# Altium schematic sheet MCU_GUI.SchDoc
size A1; SheetNumber: 6; SheetTotal: 13
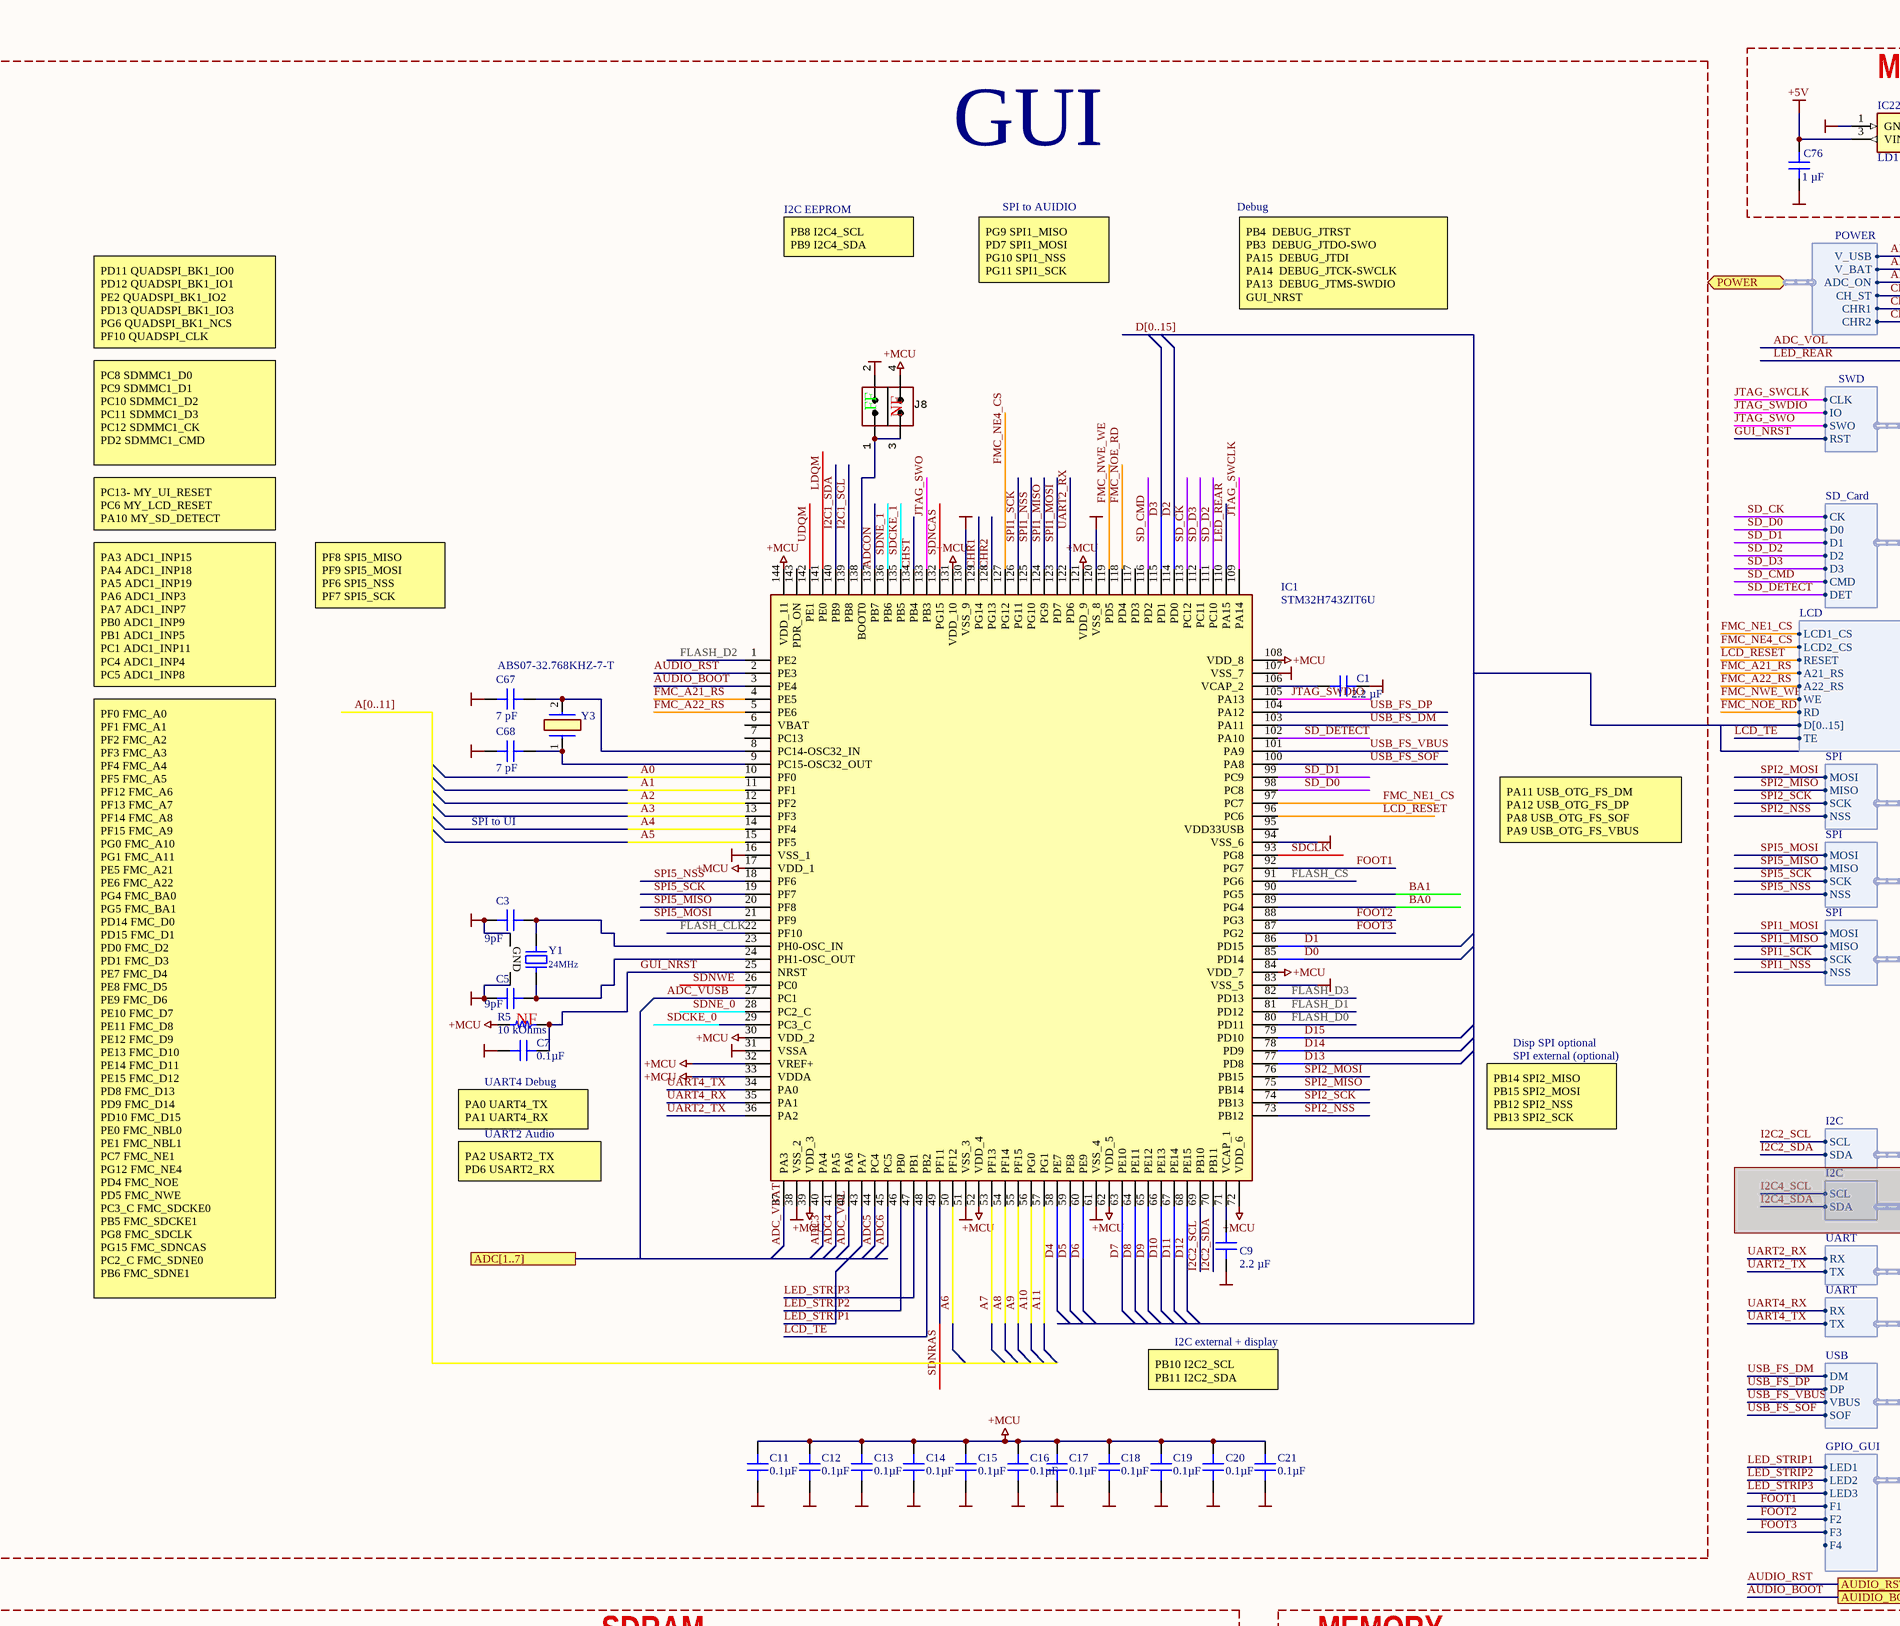
[diagram p0: MCU_GUI.SchDoc, top left]
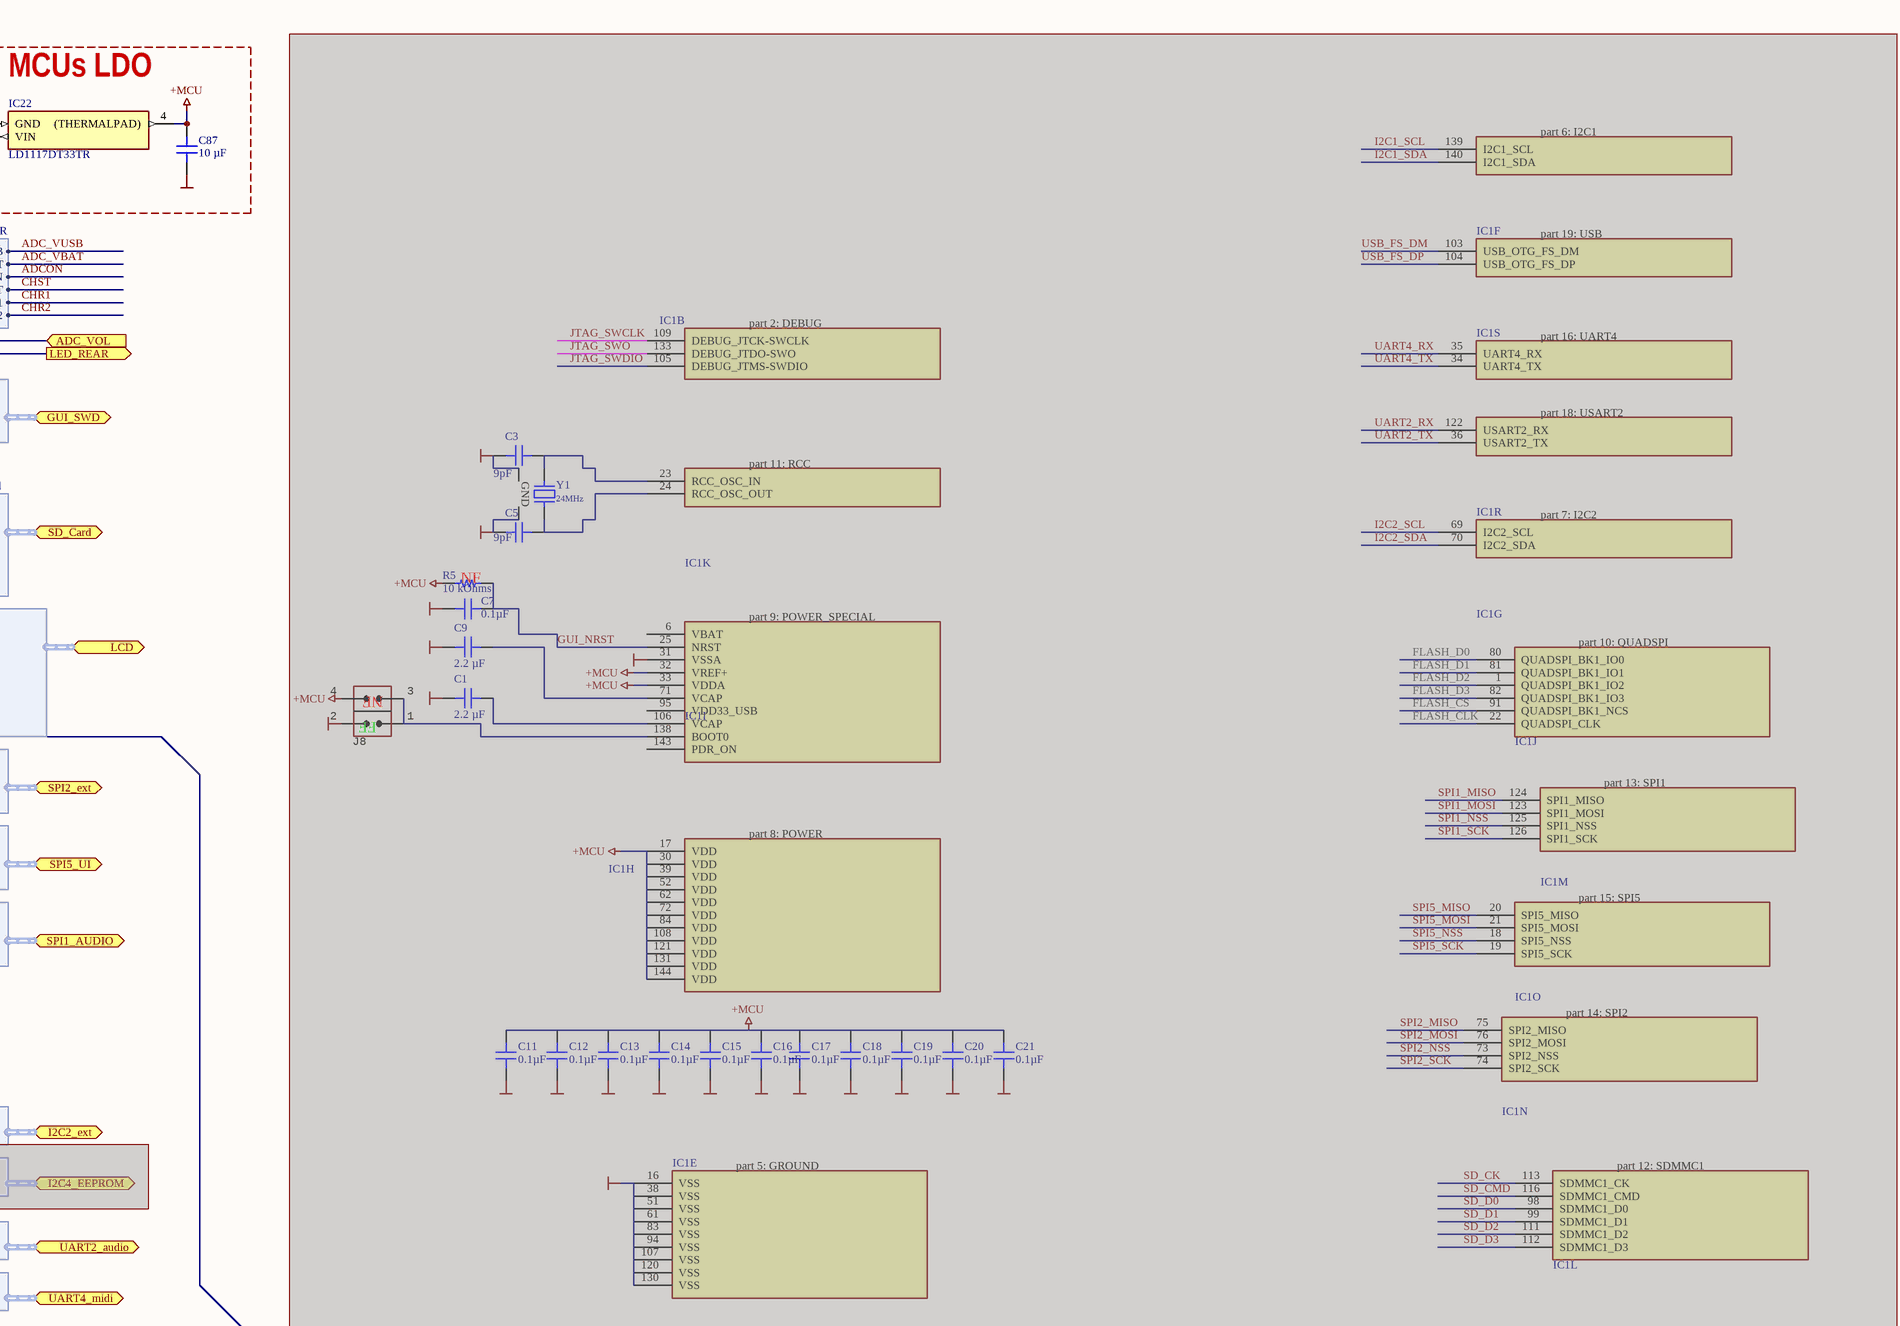
[diagram p1: MCU_GUI.SchDoc, top right]
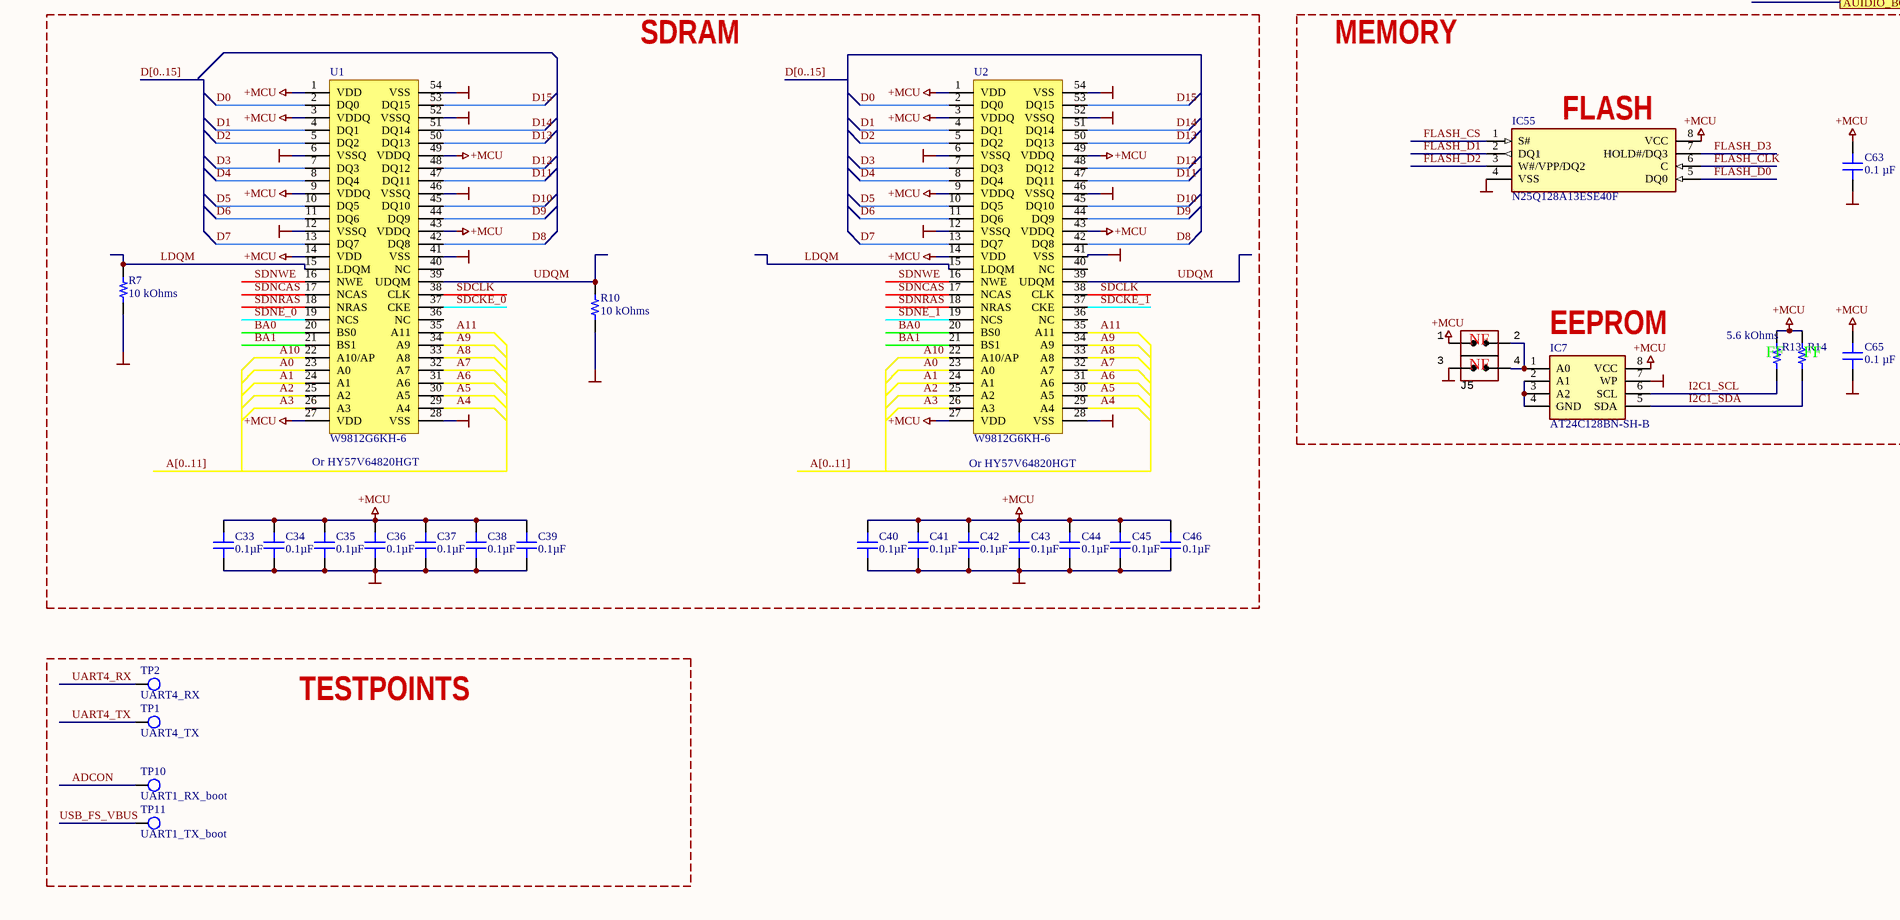
[diagram p2: MCU_GUI.SchDoc, bottom left]
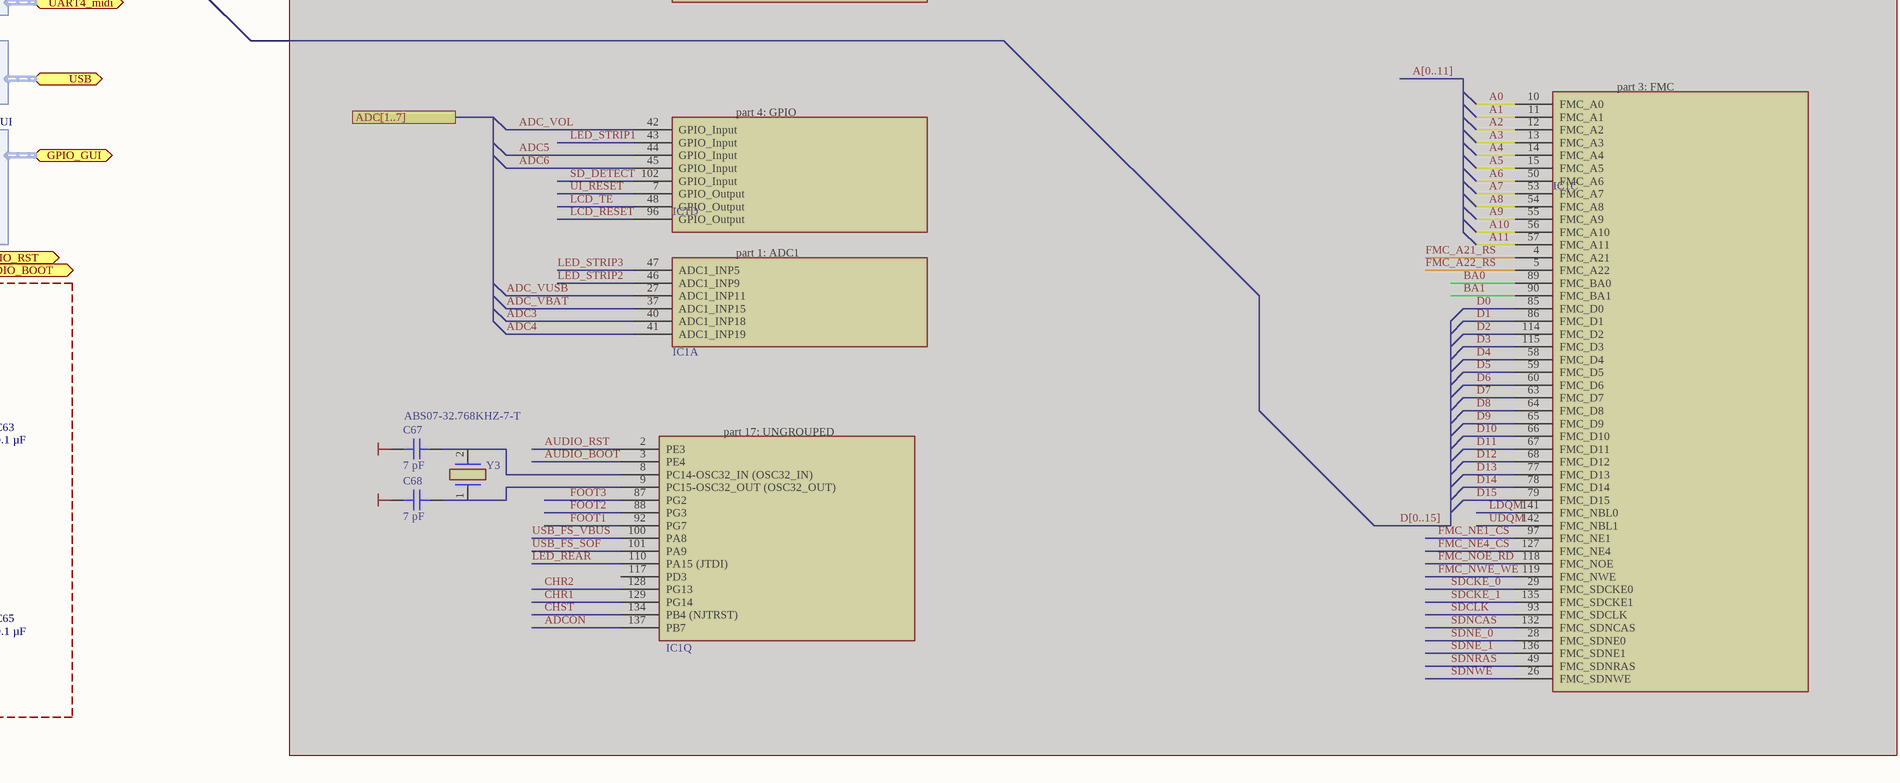
[diagram p3: MCU_GUI.SchDoc, bottom right]

## Parts
(Parts that share a designator on the sheet are numbered #1, #2 ... from top to bottom, then left to right.)
C1#1  2.2 µF  [CAP 0805_2012]
C1#2  2.2 µF  [CAP 0805_2012]  (masked out: inside a compile mask, not in the netlist)
C3#1  9pF  [CAP 0805_2012]  (masked out: inside a compile mask, not in the netlist)
C3#2  9pF  [CAP 0805_2012]
C5#1  9pF  [CAP 0805_2012]  (masked out: inside a compile mask, not in the netlist)
C5#2  9pF  [CAP 0805_2012]
C7#1  0.1µF  [CAP 0402_1005]  (masked out: inside a compile mask, not in the netlist)
C7#2  0.1µF  [CAP 0402_1005]
C9#1  2.2 µF  [CAP 0805_2012]  (masked out: inside a compile mask, not in the netlist)
C9#2  2.2 µF  [CAP 0805_2012]
C11#1  0.1µF  [CAP 0402_1005]  (masked out: inside a compile mask, not in the netlist)
C11#2  0.1µF  [CAP 0402_1005]
C12#1  0.1µF  [CAP 0402_1005]  (masked out: inside a compile mask, not in the netlist)
C12#2  0.1µF  [CAP 0402_1005]
C13#1  0.1µF  [CAP 0402_1005]  (masked out: inside a compile mask, not in the netlist)
C13#2  0.1µF  [CAP 0402_1005]
C14#1  0.1µF  [CAP 0402_1005]  (masked out: inside a compile mask, not in the netlist)
C14#2  0.1µF  [CAP 0402_1005]
C15#1  0.1µF  [CAP 0402_1005]  (masked out: inside a compile mask, not in the netlist)
C15#2  0.1µF  [CAP 0402_1005]
C16#1  0.1µF  [CAP 0402_1005]  (masked out: inside a compile mask, not in the netlist)
C16#2  0.1µF  [CAP 0402_1005]
C17#1  0.1µF  [CAP 0402_1005]  (masked out: inside a compile mask, not in the netlist)
C17#2  0.1µF  [CAP 0402_1005]
C18#1  0.1µF  [CAP 0402_1005]  (masked out: inside a compile mask, not in the netlist)
C18#2  0.1µF  [CAP 0402_1005]
C19#1  0.1µF  [CAP 0402_1005]  (masked out: inside a compile mask, not in the netlist)
C19#2  0.1µF  [CAP 0402_1005]
C20#1  0.1µF  [CAP 0402_1005]  (masked out: inside a compile mask, not in the netlist)
C20#2  0.1µF  [CAP 0402_1005]
C21#1  0.1µF  [CAP 0402_1005]  (masked out: inside a compile mask, not in the netlist)
C21#2  0.1µF  [CAP 0402_1005]
C33  0.1µF  [CAP 0402_1005]
C34  0.1µF  [CAP 0402_1005]
C35  0.1µF  [CAP 0402_1005]
C36  0.1µF  [CAP 0402_1005]
C37  0.1µF  [CAP 0402_1005]
C38  0.1µF  [CAP 0402_1005]
C39  0.1µF  [CAP 0402_1005]
C40  0.1µF  [CAP 0402_1005]
C41  0.1µF  [CAP 0402_1005]
C42  0.1µF  [CAP 0402_1005]
C43  0.1µF  [CAP 0402_1005]
C44  0.1µF  [CAP 0402_1005]
C45  0.1µF  [CAP 0402_1005]
C46  0.1µF  [CAP 0402_1005]
C63  0.1 µF  [CAP 0603_1608]
C65  0.1 µF  [CAP 0603_1608]
C67#1  7 pF  [CAP 0805_2012]
C67#2  7 pF  [CAP 0805_2012]  (masked out: inside a compile mask, not in the netlist)
C68#1  7 pF  [CAP 0805_2012]
C68#2  7 pF  [CAP 0805_2012]  (masked out: inside a compile mask, not in the netlist)
C76  1 µF  [CAP 0805_2012]
C87  10 µF  [CAP 0805_2012]
IC1#1  STM32H743ZIT6U  [QFP50P2200X2200X160-144N]
IC1#2  MCU_pinout_gui  [QFP50P2200X2200X160-144N]  (value not drawn)  (parts A,B,C,D,E,F,G,H,I,J,K,L,M,N,O,P,Q,R,S of 19)  (masked out: inside a compile mask, not in the netlist)
IC7  AT24C128BN-SH-B  [SOIC127P600X175-8N]
IC22  LD1117DT33TR  [TO228P972X240-3N]
IC55  N25Q128A13ESE40F  [SOIC127P790X216-8N]
J5  (no value)  [CON: JUMPER x2]
J8#1  (no value)  [CON: JUMPER x2]
J8#2  (no value)  [CON: JUMPER x2]  (masked out: inside a compile mask, not in the netlist)
R5#1  10 kOhms  [RES 0603_1608]  (masked out: inside a compile mask, not in the netlist)
R5#2  10 kOhms  [RES 0603_1608]
R7  10 kOhms  [RES 0603_1608]
R10  10 kOhms  [RES 0603_1608]
R13  5.6 kOhms  [RES 0603_1608]
R14  5.6 kOhms  [RES 0603_1608]  (value not drawn)
TP1  UART4_TX  [TESTPOINT_VIA]
TP2  UART4_RX  [TESTPOINT_VIA]
TP10  UART1_RX_boot  [TESTPOINT_VIA]
TP11  UART1_TX_boot  [TESTPOINT_VIA]
U1  W9812G6KH-6  [TSOP-54]
U2  W9812G6KH-6  [TSOP-54]
Y1#1  24MHz  [NDK NX3225SA]  (masked out: inside a compile mask, not in the netlist)
Y1#2  24MHz  [NDK NX3225SA]
Y3#1  ABS07-32.768KHZ-7-T  [ABS07]
Y3#2  ABS07-32.768KHZ-7-T  [ABS07]  (masked out: inside a compile mask, not in the netlist)

## Blocks framed on the sheet
MCUs LDO: C76 C87 IC22
GUI: C1#1 C3#2 C5#2 C7#2 C9#2 C11#2 C12#2 C13#2 C14#2 C15#2 C16#2 C17#2 C18#2 C19#2 C20#2 C21#2 C67#1 C68#1 IC1#1 J8#1 R5#2 Y1#2 Y3#1
SDRAM: C33-C46 R7 R10 U1 U2
TESTPOINTS: TP1 TP2 TP10 TP11

## Ports
ADC[1..7], ADC_VOL (in), AUDIO_RST (out), AUIDIO_BOOT (out), GPIO_GUI (bidir, harness GPIO_GUI), GUI_SWD (bidir, harness SWD), I2C2_ext (bidir, harness I2C), I2C4_EEPROM (bidir, harness I2C), LCD (bidir, harness LCD), LED_REAR (out), POWER (bidir, harness POWER), SD_Card (bidir, harness SD_Card), SPI1_AUDIO (bidir, harness SPI), SPI2_ext (bidir, harness SPI), SPI5_UI (bidir, harness SPI), UART2_audio (bidir, harness UART), UART4_midi (bidir, harness UART), USB (bidir, harness USB)

## Harnesses
SD_Card: CK, D0, D1, D2, D3, CMD, DET
SPI: MOSI, MISO, SCK, NSS
I2C: SCL, SDA
USB: DM, DP, VBUS, SOF
UART: RX, TX
SWD: CLK, IO, SWO, RST
POWER: V_USB, V_BAT, ADC_ON, CH_ST, CHR1, CHR2
GPIO_GUI: LED1, LED2, F1, F2, F3, F4, LED3
LCD: LCD1_CS, LCD2_CS, RESET, A21_RS, A22_RS, WE, RD, D[0..15], TE

## Nets
+5V: C76.2 IC22.3(VIN)
+MCU: C11#2.1 C12#2.1 C13#2.1 C14#2.1 C15#2.1 C16#2.1 C17#2.1 C18#2.1 C19#2.1 C20#2.1 C21#2.1 C33.1 C34.1 C35.1 C36.1 C37.1 C38.1 C39.1 C40.1 C41.1 C42.1 C43.1 C44.1 C45.1 C46.1 C63.2 C65.2 C87.2 IC1#1.17(VDD_1) IC1#1.30(VDD_2) IC1#1.32(VREF+) IC1#1.33(VDDA) IC1#1.39(VDD_3) IC1#1.52(VDD_4) IC1#1.62(VDD_5) IC1#1.72(VDD_6) IC1#1.84(VDD_7) IC1#1.108(VDD_8) IC1#1.121(VDD_9) IC1#1.131(VDD_10) IC1#1.144(VDD_11) IC7.8(VCC) IC22.4((THERMALPAD)) IC55.8(VCC) J5.1(IN) J8#1.4(IN) R5#2.1 R13.2 R14.2 U1.1(VDD) U1.3(VDDQ) U1.9(VDDQ) U1.14(VDD) U1.27(VDD) U1.43(VDDQ) U1.49(VDDQ) U2.1(VDD) U2.3(VDDQ) U2.9(VDDQ) U2.14(VDD) U2.27(VDD) U2.43(VDDQ) U2.49(VDDQ)
GND: C1#1.2 C3#2.1 C5#2.1 C7#2.1 C9#2.1 C11#2.2 C12#2.2 C13#2.2 C14#2.2 C15#2.2 C16#2.2 C17#2.2 C18#2.2 C19#2.2 C20#2.2 C21#2.2 C33.2 C34.2 C35.2 C36.2 C37.2 C38.2 C39.2 C40.2 C41.2 C42.2 C43.2 C44.2 C45.2 C46.2 C63.1 C65.1 C67#1.1 C68#1.1 C76.1 C87.1 IC1#1.16(VSS_1) IC1#1.31(VSSA) IC1#1.38(VSS_2) IC1#1.51(VSS_3) IC1#1.61(VSS_4) IC1#1.83(VSS_5) IC1#1.94(VSS_6) IC1#1.107(VSS_7) IC1#1.120(VSS_8) IC1#1.130(VSS_9) IC7.7(WP) IC22.1(GND) IC55.4(VSS) J5.3(IN) J8#1.2(IN) R7.1 R10.1 U1.6(VSSQ) U1.12(VSSQ) U1.28(VSS) U1.41(VSS) U1.46(VSSQ) U1.52(VSSQ) U1.54(VSS) U2.6(VSSQ) U2.12(VSSQ) U2.28(VSS) U2.41(VSS) U2.46(VSSQ) U2.52(VSSQ) U2.54(VSS) Y1#2.2(GND) Y1#2.4(GND)
A0: IC1#1.10(PF0) U1.23(A0) U2.23(A0)
A1: IC1#1.11(PF1) U1.24(A1) U2.24(A1)
A2: IC1#1.12(PF2) U1.25(A2) U2.25(A2)
A3: IC1#1.13(PF3) U1.26(A3) U2.26(A3)
A4: IC1#1.14(PF4) U1.29(A4) U2.29(A4)
A5: IC1#1.15(PF5) U1.30(A5) U2.30(A5)
A6: IC1#1.50(PF12) U1.31(A6) U2.31(A6)
A7: IC1#1.53(PF13) U1.32(A7) U2.32(A7)
A8: IC1#1.54(PF14) U1.33(A8) U2.33(A8)
A9: IC1#1.55(PF15) U1.34(A9) U2.34(A9)
A10: IC1#1.56(PG0) U1.22(A10/AP) U2.22(A10/AP)
A11: IC1#1.57(PG1) U1.35(A11) U2.35(A11)
ADC3: IC1#1.40(PA4)
ADC4: IC1#1.41(PA5)
ADC5: IC1#1.44(PC4)
ADC6: IC1#1.45(PC5)
ADC_VBAT: IC1#1.37(PA3) ; port POWER.V_BAT
ADC_VOL: IC1#1.42(PA6) ; port ADC_VOL
ADC_VUSB: IC1#1.27(PC1) ; port POWER.V_USB
ADCON: IC1#1.137(PB7) TP10.1 ; port POWER.ADC_ON
AUDIO_BOOT: IC1#1.3(PE4) ; port AUIDIO_BOOT
AUDIO_RST: IC1#1.2(PE3) ; port AUDIO_RST
BA0: IC1#1.89(PG4) U1.20(BS0) U2.20(BS0)
BA1: IC1#1.90(PG5) U1.21(BS1) U2.21(BS1)
CHR1: IC1#1.129(PG14) ; port POWER.CHR1
CHR2: IC1#1.128(PG13) ; port POWER.CHR2
CHST: IC1#1.134(PB4) ; port POWER.CH_ST
D0: IC1#1.85(PD14) U1.2(DQ0) U2.2(DQ0)
D1: IC1#1.86(PD15) U1.4(DQ1) U2.4(DQ1)
D2: IC1#1.114(PD0) U1.5(DQ2) U2.5(DQ2)
D3: IC1#1.115(PD1) U1.7(DQ3) U2.7(DQ3)
D4: IC1#1.58(PE7) U1.8(DQ4) U2.8(DQ4)
D5: IC1#1.59(PE8) U1.10(DQ5) U2.10(DQ5)
D6: IC1#1.60(PE9) U1.11(DQ6) U2.11(DQ6)
D7: IC1#1.63(PE10) U1.13(DQ7) U2.13(DQ7)
D8: IC1#1.64(PE11) U1.42(DQ8) U2.42(DQ8)
D9: IC1#1.65(PE12) U1.44(DQ9) U2.44(DQ9)
D10: IC1#1.66(PE13) U1.45(DQ10) U2.45(DQ10)
D11: IC1#1.67(PE14) U1.47(DQ11) U2.47(DQ11)
D12: IC1#1.68(PE15) U1.48(DQ12) U2.48(DQ12)
D13: IC1#1.77(PD8) U1.50(DQ13) U2.50(DQ13)
D14: IC1#1.78(PD9) U1.51(DQ14) U2.51(DQ14)
D15: IC1#1.79(PD10) U1.53(DQ15) U2.53(DQ15)
FLASH_CLK: IC1#1.22(PF10) IC55.6(C)
FLASH_CS: IC1#1.91(PG6) IC55.1(S#)
FLASH_D0: IC1#1.80(PD11) IC55.5(DQ0)
FLASH_D1: IC1#1.81(PD12) IC55.2(DQ1)
FLASH_D2: IC1#1.1(PE2) IC55.3(W#/VPP/DQ2)
FLASH_D3: IC1#1.82(PD13) IC55.7(HOLD#/DQ3)
FMC_A21_RS: IC1#1.4(PE5) ; port LCD.A21_RS
FMC_A22_RS: IC1#1.5(PE6) ; port LCD.A22_RS
FMC_NE1_CS: IC1#1.97(PC7) ; port LCD.LCD1_CS
FMC_NE4_CS: IC1#1.127(PG12) ; port LCD.LCD2_CS
FMC_NOE_RD: IC1#1.118(PD4) ; port LCD.RD
FMC_NWE_WE: IC1#1.119(PD5) ; port LCD.WE
FOOT1: IC1#1.92(PG7) ; port GPIO_GUI.F1
FOOT2: IC1#1.88(PG3) ; port GPIO_GUI.F2
FOOT3: IC1#1.87(PG2) ; port GPIO_GUI.F3
GUI_NRST: C7#2.2 IC1#1.25(NRST) R5#2.2 ; port GUI_SWD.RST
I2C1_SCL: IC1#1.139(PB8) IC7.6(SCL) R13.1
I2C1_SDA: IC1#1.140(PB9) IC7.5(SDA) R14.1
I2C2_SCL: IC1#1.69(PB10) ; port I2C2_ext.SCL
I2C2_SDA: IC1#1.70(PB11) ; port I2C2_ext.SDA
JTAG_SWCLK: IC1#1.109(PA14) ; port GUI_SWD.CLK
JTAG_SWDIO: IC1#1.105(PA13) ; port GUI_SWD.IO
JTAG_SWO: IC1#1.133(PB3) ; port GUI_SWD.SWO
LCD_RESET: IC1#1.96(PC6) ; port LCD.RESET
LCD_TE: IC1#1.48(PB2) ; port LCD.TE
LDQM: IC1#1.141(PE0) R7.2 U1.15(LDQM) U2.15(LDQM)
LED_REAR: IC1#1.110(PA15) ; port LED_REAR
LED_STRIP1: IC1#1.43(PA7) ; port GPIO_GUI.LED1
LED_STRIP2: IC1#1.46(PB0) ; port GPIO_GUI.LED2
LED_STRIP3: IC1#1.47(PB1) ; port GPIO_GUI.LED3
SD_CK: IC1#1.113(PC12) ; port SD_Card.CK
SD_CMD: IC1#1.116(PD2) ; port SD_Card.CMD
SD_D0: IC1#1.98(PC8) ; port SD_Card.D0
SD_D1: IC1#1.99(PC9) ; port SD_Card.D1
SD_D2: IC1#1.111(PC10) ; port SD_Card.D2
SD_D3: IC1#1.112(PC11) ; port SD_Card.D3
SD_DETECT: IC1#1.102(PA10) ; port SD_Card.DET
SDCKE_0: IC1#1.29(PC3_C) U1.37(CKE)
SDCKE_1: IC1#1.135(PB5) U2.37(CKE)
SDCLK: IC1#1.93(PG8) U1.38(CLK) U2.38(CLK)
SDNCAS: IC1#1.132(PG15) U1.17(NCAS) U2.17(NCAS)
SDNE_0: IC1#1.28(PC2_C) U1.19(NCS)
SDNE_1: IC1#1.136(PB6) U2.19(NCS)
SDNRAS: IC1#1.49(PF11) U1.18(NRAS) U2.18(NRAS)
SDNWE: IC1#1.26(PC0) U1.16(NWE) U2.16(NWE)
SPI1_MISO: IC1#1.124(PG9) ; port SPI1_AUDIO.MISO
SPI1_MOSI: IC1#1.123(PD7) ; port SPI1_AUDIO.MOSI
SPI1_NSS: IC1#1.125(PG10) ; port SPI1_AUDIO.NSS
SPI1_SCK: IC1#1.126(PG11) ; port SPI1_AUDIO.SCK
SPI2_MISO: IC1#1.75(PB14) ; port SPI2_ext.MISO
SPI2_MOSI: IC1#1.76(PB15) ; port SPI2_ext.MOSI
SPI2_NSS: IC1#1.73(PB12) ; port SPI2_ext.NSS
SPI2_SCK: IC1#1.74(PB13) ; port SPI2_ext.SCK
SPI5_MISO: IC1#1.20(PF8) ; port SPI5_UI.MISO
SPI5_MOSI: IC1#1.21(PF9) ; port SPI5_UI.MOSI
SPI5_NSS: IC1#1.18(PF6) ; port SPI5_UI.NSS
SPI5_SCK: IC1#1.19(PF7) ; port SPI5_UI.SCK
UART2_RX: IC1#1.122(PD6) ; port UART2_audio.RX
UART2_TX: IC1#1.36(PA2) ; port UART2_audio.TX
UART4_RX: IC1#1.35(PA1) TP2.1 ; port UART4_midi.RX
UART4_TX: IC1#1.34(PA0) TP1.1 ; port UART4_midi.TX
UDQM: IC1#1.142(PE1) R10.2 U1.39(UDQM) U2.39(UDQM)
USB_FS_DM: IC1#1.103(PA11) ; port USB.DM
USB_FS_DP: IC1#1.104(PA12) ; port USB.DP
USB_FS_SOF: IC1#1.100(PA8) ; port USB.SOF
USB_FS_VBUS: IC1#1.101(PA9) TP11.1 ; port USB.VBUS
NetC1#1_1: C1#1.1 IC1#1.106(VCAP_2)
NetC3#2_2: C3#2.2 IC1#1.23(PH0-OSC_IN) Y1#2.1
NetC5#2_2: C5#2.2 IC1#1.24(PH1-OSC_OUT) Y1#2.3
NetC9#2_2: C9#2.2 IC1#1.71(VCAP_1)
NetC67#1_2: C67#1.2 IC1#1.8(PC14-OSC32_IN) Y3#1.2
NetC68#1_2: C68#1.2 IC1#1.9(PC15-OSC32_OUT) Y3#1.1
NetIC1#1_138: IC1#1.138(BOOT0) J8#1.1(IN) J8#1.3(IN)
NetIC7_1: IC7.1(A0) J5.2(IN) J5.4(IN)
NetIC7_2: IC7.2(A1) IC7.3(A2) IC7.4(GND)

Not connected (* = marked no-connect by the designer): IC1#1 6(VBAT) 7(PC13) 95(VDD33USB) 117(PD3) 143(PDR_ON); U1 36(NC) 40(NC); U2 36(NC) 40(NC)

## Buses and harness runs
bus A[0..11]
bus D[0..15]

## Notes on the sheet
- I2C EEPROM
- SPI to AUIDIO
- Debug
- PB8	I2C4_SCL
  PB9	I2C4_SDA
- PG9	SPI1_MISO
  PD7	SPI1_MOSI
  PG10	SPI1_NSS
  PG11	SPI1_SCK
- PD11	QUADSPI_BK1_IO0
  PD12	QUADSPI_BK1_IO1
  PE2	QUADSPI_BK1_IO2
  PD13	QUADSPI_BK1_IO3
  PG6	QUADSPI_BK1_NCS
  PF10	QUADSPI_CLK
- PB4 	DEBUG_JTRST
  PB3 	DEBUG_JTDO-SWO
  PA15 	DEBUG_JTDI
  PA14 	DEBUG_JTCK-SWCLK
  PA13 	DEBUG_JTMS-SWDIO
  GUI_NRST
- (near J8#1) FF
- (near J8#1) NF
- PC8	SDMMC1_D0
  PC9	SDMMC1_D1
  PC10	SDMMC1_D2
  PC11	SDMMC1_D3
  PC12	SDMMC1_CK
  PD2	SDMMC1_CMD
- PC13-	MY_UI_RESET
  PC6	MY_LCD_RESET
  PA10	MY_SD_DETECT
- PF8	SPI5_MISO
  PF9	SPI5_MOSI
  PF6	SPI5_NSS
  PF7	SPI5_SCK
- (near R5#1) NF
- PA3	ADC1_INP15
  PA4	ADC1_INP18
  PA5	ADC1_INP19
  PA6	ADC1_INP3
  PA7	ADC1_INP7
  PB0	ADC1_INP9
  PB1	ADC1_INP5
  PC1	ADC1_INP11
  PC4	ADC1_INP4
  PC5	ADC1_INP8
- (near J8#2) FF
- (near J8#2) NF
- SPI to UI
- PA11	USB_OTG_FS_DM
  PA12	USB_OTG_FS_DP
  PA8	USB_OTG_FS_SOF
  PA9	USB_OTG_FS_VBUS
- (near R5#2) NF
- Disp SPI optional
- SPI external (optional)
- (near C7#2) PA0	UART4_TX
  PA1	UART4_RX
- (near C7#2) UART4 Debug
- PB14	SPI2_MISO
  PB15	SPI2_MOSI
  PB12	SPI2_NSS
  PB13	SPI2_SCK
- PA2	USART2_TX
  PD6	USART2_RX
- UART2 Audio
- PF0	FMC_A0
  PF1	FMC_A1
  PF2	FMC_A2
  PF3	FMC_A3
  PF4	FMC_A4
  PF5	FMC_A5
  PF12	FMC_A6
  PF13	FMC_A7
  PF14	FMC_A8
  PF15	FMC_A9
  PG0	FMC_A10
  PG1	FMC_A11
  PE5	FMC_A21
  PE6	FMC_A22
  PG4	FMC_BA0
  PG5	FMC_BA1
  PD14	FMC_D0
  PD15	FMC_D1
  PD0	FMC_D2
  PD1	FMC_D3
  PE7	FMC_D4
  PE8	FMC_D5
  PE9	FMC_D6
  PE10	FMC_D7
  PE11	FMC_D8
  PE12	FMC_D9
  PE13	FMC_D10
  PE14	FMC_D11
  PE15	FMC_D12
  PD8	FMC_D13
  PD9	FMC_D14
  PD10	FMC_D15
  PE0	FMC_NBL0
  PE1	FMC_NBL1
  PC7	FMC_NE1
  PG12	FMC_NE4
  PD4	FMC_NOE
  PD5	FMC_NWE
  PC3_C	FMC_SDCKE0
  PB5	FMC_SDCKE1
  PG8	FMC_SDCLK
  PG15	FMC_SDNCAS
  PC2_C	FMC_SDNE0
  PB6	FMC_SDNE1
- PB10	I2C2_SCL
  PB11	I2C2_SDA
- I2C external + display
- MEMORY
- (near IC55) FLASH
- (near J5) NF
- (near IC7) EEPROM
- (near R13) FF
- (near R14) FF
- (near U1) Or HY57V64820HGT
- (near U2) Or HY57V64820HGT
- (in symbol MCU_pinout_gui, part A) part 1: ADC1
- (in symbol MCU_pinout_gui, part B) part 2: DEBUG
- (in symbol MCU_pinout_gui, part C) part 3: FMC
- (in symbol MCU_pinout_gui, part D) part 4: GPIO
- (in symbol MCU_pinout_gui, part E) part 5: GROUND
- (in symbol MCU_pinout_gui, part F) part 6: I2C1
- (in symbol MCU_pinout_gui, part G) part 7: I2C2
- (in symbol MCU_pinout_gui, part H) part 8: POWER
- (in symbol MCU_pinout_gui, part I) part 9: POWER_SPECIAL
- (in symbol MCU_pinout_gui, part J) part 10: QUADSPI
- (in symbol MCU_pinout_gui, part K) part 11: RCC
- (in symbol MCU_pinout_gui, part L) part 12: SDMMC1
- (in symbol MCU_pinout_gui, part M) part 13: SPI1
- (in symbol MCU_pinout_gui, part N) part 14: SPI2
- (in symbol MCU_pinout_gui, part O) part 15: SPI5
- (in symbol MCU_pinout_gui, part P) part 16: UART4
- (in symbol MCU_pinout_gui, part Q) part 17: UNGROUPED
- (in symbol MCU_pinout_gui, part R) part 18: USART2
- (in symbol MCU_pinout_gui, part S) part 19: USB

## Library data of the parts
C1#1 C1#2 C9#1 C9#2 = C0805C225K8RAC7800: CAP CER 2.2UF 10V X7R 0805; manufacturer: KEMET; Tolerance: ±10%; Part Number: C0805C225K8RAC7800; Value: 2.2 µF; Applications: Bypass, Decoupling; Capacitance: 2.2 µF; componentlink1description: Datasheet; componentlink1url: https://api.kemet.com/component-edge/download/datasheet/C0805C225K8RACTU.pdf; componentlink2description: DigiKey Link; componentlink2url: https://www.digikey.com/en/products/detail/kemet/C0805C225K8RAC7800/789654; Device Package: 0805 (2012 Metric); lastupdated: 3/27/2023 7:09:32 PM; Lifecycle Status: Active; Minimum Order: 1; Mounting Type: Surface Mount, MLCC; Operating Temperature: -55°C ~ 125°C; Package / Case: 0805 (2012 Metric); packaging: TapeAndReel; partid: 32363; Part Status: Active; price: 0.03; series: SMD Comm X7R; Size / Dimension: 0.079" L x 0.049" W (2.00mm x 1.25mm); Supplier 1: DigiKey; Supplier Part Number 1: 399-C0805C225K8RAC7800CT-ND; Temperature Coefficient: X7R; Thickness (Max): 0.055" (1.40mm); Voltage - Rated: 10V
C3#1 C3#2 C5#1 C5#2 = CBR08C909CAGAC: CAP CER 9PF 250V C0G/NP0 0805; Manufacturer: KEMET; Temperature Coefficient: C0G, NP0; Tolerance: ±0.25pF; Part Number: CBR08C909CAGAC; Value: 9pF; Applications: RF, Microwave, High Frequency; Capacitance: 9pF; ComponentLink1Description: Datasheet; ComponentLink1URL: https://api.kemet.com/component-edge/download/datasheet/CBR08C909CAGAC.pdf; ComponentLink2Description: DigiKey Link; ComponentLink2URL: http://digikey.com/product-detail/en/kemet/CBR08C909CAGAC/399-8711-1-ND/3480335; Device Package: 0805 (2012 Metric); Features: High Q, Low Loss, Ultra Low ESR; LastUpdated: 9/2/2020 1:04:31 AM; Lifecycle Status: Active; Minimum Order: 1; Mounting Type: Surface Mount, MLCC; Operating Temperature: -55°C ~ 125°C; Package / Case: 0805 (2012 Metric); Packaging: TapeAndReel; PartId: 8592; Part Status: Active; Price: 0.28; Series: CBR-SMD RF C0G; Size / Dimension: 0.079" L x 0.049" W (2.00mm x 1.25mm); Supplier 1: DigiKey; Supplier Part Number 1: 399-8711-1-ND; Thickness (Max): 0.035" (0.88mm); Voltage - Rated: 250V
C7#1 C7#2 C11#1 C11#2 C12#1 C12#2 C13#1 C13#2 C14#1 C14#2 C15#1 C15#2 C16#1 C16#2 C17#1 C17#2 C18#1 C18#2 C19#1 C19#2 C20#1 C20#2 C21#1 C21#2 C33-C46 = C0402C104K4RACAUTO: CAP CER 0.1UF 16V X7R 0402; Manufacturer: KEMET; Tolerance: ±10%; Part Number: C0402C104K4RACAUTO; Value: 0.1µF; Applications: Automotive, Bypass, Decoupling; Capacitance: 0.1µF; ComponentLink1Description: Datasheet; ComponentLink1URL: https://api.kemet.com/component-edge/download/specsheet/C0402C104K4RACAUTO.pdf; ComponentLink2Description: DigiKey Link; ComponentLink2URL: http://digikey.com/product-detail/en/kemet/C0402C104K4RACAUTO/399-6828-1-ND/3314343; Device Package: 0402 (1005 Metric); LastUpdated: 9/2/2020 1:02:21 AM; Lifecycle Status: Active; Minimum Order: 1; Mounting Type: Surface Mount, MLCC; Operating Temperature: -55°C ~ 125°C; Package / Case: 0402 (1005 Metric); Packaging: TapeAndReel; PartId: 3024; Part Status: Active; Price: 0.01; Ratings: AEC-Q200; Series: SMD Auto X7R; Size / Dimension: 0.039" L x 0.020" W (1.00mm x 0.50mm); Supplier 1: DigiKey; Supplier Part Number 1: 399-6828-1-ND; Temperature Coefficient: X7R; Thickness (Max): 0.022" (0.55mm); Voltage - Rated: 16V
C63 C65 = C0603C104K5RAC7411: CAP CER 0.1UF 50V X7R 0603; manufacturer: KEMET; Tolerance: ±10%; Part Number: C0603C104K5RAC7411; Value: 0.1 µF; Applications: Bypass, Decoupling; Capacitance: 0.1 µF; componentlink1description: Datasheet; componentlink1url: https://api.kemet.com/component-edge/download/datasheet/C0603C104K5RAC7411.pdf; componentlink2description: DigiKey Link; componentlink2url: https://www.digikey.com/en/products/detail/kemet/C0603C104K5RAC7411/3317013; Device Package: 0603 (1608 Metric); lastupdated: 2/9/2024 8:10:30 PM; Lifecycle Status: Active; Minimum Order: 1; Mounting Type: Surface Mount, MLCC; Operating Temperature: -55°C ~ 125°C; Package / Case: 0603 (1608 Metric); packaging: TapeAndReel; partid: 2233; Part Status: Active; price: 0.01; series: SMD Comm X7R; Size / Dimension: 0.063" L x 0.031" W (1.60mm x 0.80mm); Supplier 1: DigiKey; Supplier Part Number 1: 399-C0603C104K5RAC7411CT-ND; Temperature Coefficient: X7R; Thickness (Max): 0.035" (0.90mm); Voltage - Rated: 50V
C67#1 C67#2 C68#1 C68#2 = CC0805DRNPO9BN7R0: CAP CER 7PF 50V C0G/NPO 0805; manufacturer: Yageo; Temperature Coefficient: C0G, NP0; Tolerance: ±0.5pF; Part Number: CC0805DRNPO9BN7R0; Value: 7 pF; Applications: General Purpose; Capacitance: 7 pF; componentlink1description: Datasheet; componentlink1url: https://www.yageo.com/upload/media/product/productsearch/datasheet/mlcc/UPY-GP_NP0_16V-to-50V_17.pdf; componentlink2description: DigiKey Link; componentlink2url: https://www.digikey.com/en/products/detail/yageo/CC0805DRNPO9BN7R0/302830; Device Package: 0805 (2012 Metric); lastupdated: 9/8/2023 7:12:10 PM; Lifecycle Status: Active; Minimum Order: 1; Mounting Type: Surface Mount, MLCC; Operating Temperature: -55°C ~ 125°C; Package / Case: 0805 (2012 Metric); packaging: TapeAndReel; partid: 8360; Part Status: Active; price: 0.01; series: CC; Size / Dimension: 0.079" L x 0.049" W (2.00mm x 1.25mm); Supplier 1: DigiKey; Supplier Part Number 1: 311-1096-1-ND; Thickness (Max): 0.024" (0.60mm); Voltage - Rated: 50V
C76 = C0805C105K4RAC7800: CAP CER 1UF 16V X7R 0805; manufacturer: KEMET; Tolerance: ±10%; Part Number: C0805C105K4RAC7800; Value: 1 µF; Applications: Bypass, Decoupling; Capacitance: 1 µF; componentlink1description: Datasheet; componentlink1url: https://api.kemet.com/component-edge/download/datasheet/C0805C105K4RACTU.pdf; componentlink2description: DigiKey Link; componentlink2url: https://www.digikey.com/en/products/detail/kemet/C0805C105K4RAC7800/416047; Device Package: 0805 (2012 Metric); lastupdated: 9/19/2022 1:03:30 PM; Lifecycle Status: Active; Minimum Order: 1; Mounting Type: Surface Mount, MLCC; Operating Temperature: -55°C ~ 125°C; Package / Case: 0805 (2012 Metric); packaging: TapeAndReel; partid: 32075; Part Status: Active; price: 0.01; series: SMD Comm X7R; Size / Dimension: 0.079" L x 0.049" W (2.00mm x 1.25mm); Supplier 1: DigiKey; Supplier Part Number 1: 399-C0805C105K4RAC7800CT-ND; Temperature Coefficient: X7R; Thickness (Max): 0.039" (1.00mm); Voltage - Rated: 16V
C87 = C0805C106K8PAC7800: CAP CER 10UF 10V X5R 0805; manufacturer: KEMET; Tolerance: ±10%; Part Number: C0805C106K8PAC7800; Value: 10 µF; Applications: Bypass, Decoupling; Capacitance: 10 µF; componentlink1description: Datasheet; componentlink1url: https://connect.kemet.com:7667/gateway/IntelliData-ComponentDocumentation/1.0/download/datasheet/C0805C106K8PACTU; componentlink2description: DigiKey Link; componentlink2url: https://www.digikey.com/en/products/detail/kemet/C0805C106K8PAC7800/1090830; Device Package: 0805 (2012 Metric); lastupdated: 9/14/2022 7:51:56 AM; Lifecycle Status: Active; Minimum Order: 1; Mounting Type: Surface Mount, MLCC; Operating Temperature: -55°C ~ 85°C; Package / Case: 0805 (2012 Metric); packaging: TapeAndReel; partid: 44790; Part Status: Active; price: 0.02; series: SMD Comm X5R; Size / Dimension: 0.079" L x 0.049" W (2.00mm x 1.25mm); Supplier 1: DigiKey; Supplier Part Number 1: 399-C0805C106K8PAC7800CT-ND; Temperature Coefficient: X5R; Thickness (Max): 0.055" (1.40mm); Voltage - Rated: 10V
IC1#1 = STM32H743ZIT6U: Integrated Circuit; Manufacturer_Name: STMicroelectronics; Datasheet Link: https://componentsearchengine.com/Datasheets/1/STM32H743ZIT6U.pdf; Height: 1.6mm; Manufacturer_Part_Number: STM32H743ZIT6U; Mouser Part Number: N/A; Mouser Price/Stock: https://www.mouser.co.uk/ProductDetail/STMicroelectronics/STM32H743ZIT6U?qs=PzGy0jfpSMtTUBlZwwPqMQ%3D%3D
IC1#2 = MCU_pinout_gui: MCU with 144 pins / Grouped by function
IC7 = AT24C128BN-SH-B: Integrated Circuit; Manufacturer_Name: Microchip; Datasheet Link: https://componentsearchengine.com/Datasheets/1/AT24C128BN-SH-B.pdf; Height: 1.75mm; Manufacturer_Part_Number: AT24C128BN-SH-B; Mouser Part Number: 556-A24C128BNSH-B; Mouser Price/Stock: https://www.mouser.co.uk/ProductDetail/Microchip-Technology-Atmel/AT24C128BN-SH-B?qs=j6lVIf5KywAfpl9r4qbAuQ%3D%3D
IC22 = LD1117DT33TR: Integrated Circuit; Manufacturer_Name: STMicroelectronics; Datasheet Link: http://www.st.com/web/en/resource/technical/document/datasheet/CD00000544.pdf; Height: 2.4mm; Manufacturer_Part_Number: LD1117DT33TR; Mouser Part Number: 511-LD1117DT33-TR; Mouser Price/Stock: https://www.mouser.co.uk/ProductDetail/STMicroelectronics/LD1117DT33TR?qs=4JhUBQGAOSd4P5jVYGxp2g%3D%3D; Arrow Part Number: LD1117DT33TR; Arrow Price/Stock: https://www.arrow.com/en/products/ld1117dt33tr/stmicroelectronics?region=nac
IC55 = N25Q128A13ESE40F: Integrated Circuit; Manufacturer_Name: Micron; Datasheet Link: https://datasheet.datasheetarchive.com/originals/distributors/Datasheets-DGA23/1494983.pdf; Height: 2.16mm; Manufacturer_Part_Number: N25Q128A13ESE40F; Mouser Part Number: 340-182267; Mouser Price/Stock: https://www.mouser.co.uk/ProductDetail/Micron/N25Q128A13ESE40F?qs=taEdVNyAfdHw8xv9Y4zfpQ%3D%3D; Arrow Part Number: N25Q128A13ESE40F; Arrow Price/Stock: https://www.arrow.com/en/products/n25q128a13ese40f/micron-technology
J5 J8#1 J8#2 = Jumper_double: CommentText: "Перемычка"
R5#1 R5#2 R7 R10 = ERJ-3EKF1002V: RES SMD 10K OHM 1% 1/10W 0603; Manufacturer: Panasonic Electronic Components; Power (Watts): 0.1W, 1/10W; Temperature Coefficient: ±100ppm/°C; Part Number: ERJ-3EKF1002V; Value: 10 kOhms; ComponentLink1Description: Datasheet; ComponentLink1URL: https://industrial.panasonic.com/cdbs/www-data/pdf/RDA0000/AOA0000C304.pdf; ComponentLink2Description: DigiKey Link; ComponentLink2URL: https://www.digikey.com/en/products/detail/panasonic-electronic-components/ERJ-3EKF1002V/196066; Composition: Thick Film; Device Package: 0603 (1608 Metric); Height - Seated (Max): 0.022" (0.55mm); LastUpdated: 2/9/2024 8:41:59 PM; Lifecycle Status: Active; Minimum Order: 1; Number of Terminations: 2; Operating Temperature: -55°C ~ 155°C; Package / Case: 0603 (1608 Metric); Packaging: TapeAndReel; PartId: 25695; Part Status: Active; Price: 0.01; Resistance: 10 kOhms; Series: ERJ-3EK; Size / Dimension: 0.063" L x 0.031" W (1.60mm x 0.80mm); Supplier 1: DigiKey; Supplier Part Number 1: P10.0KHCT-ND; Supplier Device Package: 0603; Tolerance: ±1%; Features: Automotive AEC-Q200; Ratings: AEC-Q200
R13 R14 = RT0603DRE075K6L: RES SMD 5.6K OHM 0.5% 1/10W 0603; Manufacturer: Yageo; Power (Watts): 0.1W, 1/10W; Temperature Coefficient: ±50ppm/°C; Part Number: RT0603DRE075K6L; Value: 5.6 kOhms; ComponentLink1Description: Datasheet; ComponentLink1URL: https://www.yageo.com/upload/media/product/productsearch/datasheet/rchip/PYu-RT_1-to-0.01_RoHS_L_11.pdf; ComponentLink2Description: DigiKey Link; ComponentLink2URL: http://digikey.com/product-detail/en/yageo/RT0603DRE075K6L/311-2635-1-ND/6129054; Composition: Thin Film; Device Package: 0603 (1608 Metric); Height - Seated (Max): 0.022" (0.55mm); LastUpdated: 9/2/2020 1:10:05 AM; Lifecycle Status: Active; Minimum Order: 1; Number of Terminations: 2; Operating Temperature: -55°C ~ 155°C; Package / Case: 0603 (1608 Metric); Packaging: TapeAndReel; PartId: 14197; Part Status: Active; Price: 0.01; Resistance: 5.6 kOhms; Series: RT; Size / Dimension: 0.063" L x 0.031" W (1.60mm x 0.80mm); Supplier 1: DigiKey; Supplier Part Number 1: 311-2635-1-ND; Supplier Device Package: 0603; Tolerance: ±0.5%
TP1 TP2 TP10 TP11 = TestPoint
Y1#1 Y1#2 = NX3225SA-24MHZ-EXS00A-CS07532: CRYSTAL 24MHZ 9PF SMD; Manufacturer: NDK America, Inc.; ESR (Equivalent Series Resistance): 100 Ohms; Operating Mode: Fundamental; Part Number: NX3225SA-24MHZ-EXS00A-CS07532; ComponentLink2Description: DigiKey Link; ComponentLink2URL: http://digikey.com/product-detail/en/ndk-america-inc/NX3225SA-24MHZ-EXS00A-CS07532/644-1393-1-ND/9172121; Frequency: 24MHz; Height - Seated (Max): 0.024" (0.60mm); LastUpdated: 9/2/2020 1:21:59 AM; Lifecycle Status: Active; Load Capacitance: 9pF; Minimum Order: 1; Mounting Type: Surface Mount; Operating Temperature: -40°C ~ 150°C; Package / Case: 4-SMD, No Lead; Packaging: TapeAndReel; PartId: 571; Part Status: Active; Price: 0.38; Ratings: AEC-Q200; Series: NX3225SA; Size / Dimension: 0.126" L x 0.098" W (3.20mm x 2.50mm); Supplier 1: DigiKey; Supplier Part Number 1: 644-1393-1-ND; Type: MHz Crystal; Value: 24MHz
Y3#1 Y3#2 = ABS07-32.768KHZ-7-T: Crystal or Oscillator; Manufacturer_Name: ABRACON; Datasheet Link: https://abracon.com/Resonators/ABS07.pdf; Height: 0.9mm; Manufacturer_Part_Number: ABS07-32.768KHZ-7-T; Mouser Part Number: 815-ABS07-32.768K7T; Mouser Price/Stock: https://www.mouser.co.uk/ProductDetail/ABRACON/ABS07-32.768KHZ-7-T?qs=2nyfZ6BV3oibNEFok2qBLA%3D%3D; Arrow Part Number: ABS07-32.768KHZ-7-T; Arrow Price/Stock: https://www.arrow.com/en/products/abs07-32.768khz-7-t/abracon?region=nac